# EAGLE design uduck (EAGLE 7.6.0)
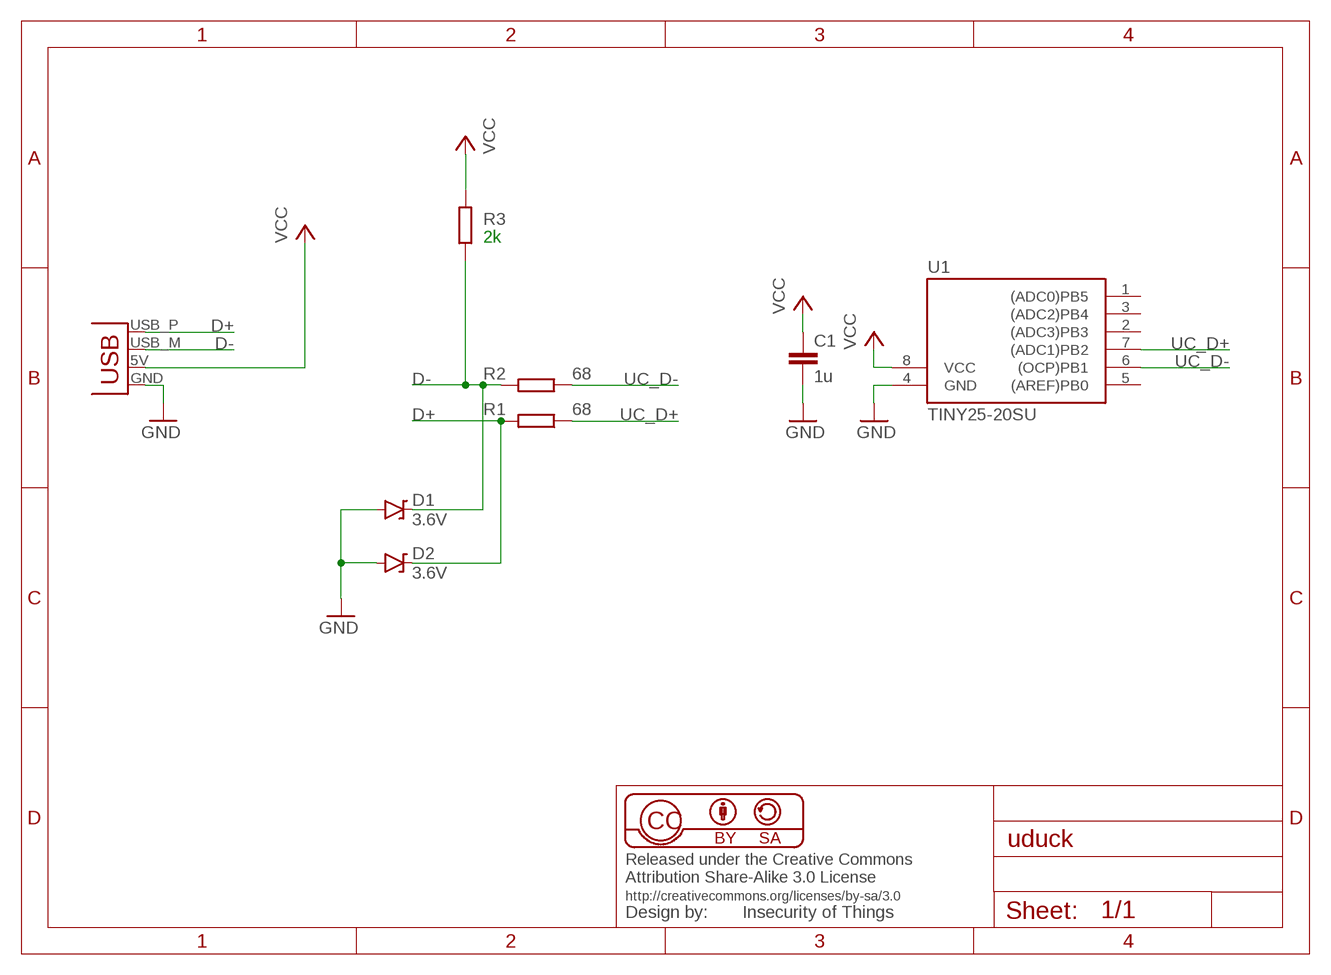
[diagram p0: schematic, sheet 1]

## Parts
C1  1u  C-EUC0805  [C0805]
D1  3.6V  DIODE-ZENER3.3V  [SOD-323]
D2  3.6V  DIODE-ZENER3.3V  [SOD-323]
R1  68  R-EU_R0603  [R0603]
R2  68  R-EU_R0603  [R0603]
R3  2k  R-EU_R0603  [R0603]
U1  TINY25-20SU  [SOIC8]
X1  USBPCB  [USB-A-PCB]

## Nets
D+: D2.C R1.2 X1.USB_P(D+)
D-: D1.C R2.2 R3.1 X1.USB_M(D-)
GND: C1.2 D1.A D2.A U1.4(GND) X1.GND
UC_D+: R1.1 U1.7((ADC1)PB2)
UC_D-: R2.1 U1.6((OCP)PB1)
VCC: C1.1 R3.2 U1.8(VCC) X1.5V(VBUS)
Unconnected: U1.1((ADC0)PB5) U1.2((ADC3)PB3) U1.3((ADC2)PB4) U1.5((AREF)PB0)

## Library data of the parts
C1 = rcl:C-EU: CAPACITOR, European symbol
D1 D2 = SparkFun-DiscreteSemi:DIODE-ZENER: Zener Diode Production Part - 8199 3.4V Zener Voltage; PROD_ID: DIO-11284; VALUE: 3.3V
R1-R3 = rcl:R-EU_: RESISTOR, European symbol
U1 = avr-5:TINY25
X1 = sparkfun:USB: USB Connectors USB-B-PTH is fully proven SKU : PRT-00139 USB-miniB is fully proven SKU : PRT-00587 USB-A-PCB is untested. USB-A-H is throughly reviewed, but untested. Spark Fun Electronics SKU : PRT-00437 USB-B-SMT is throughly reviewed, but untested. Needs silkscreen touching up. USB-A-S has not been used/tested USB-MB-H has not been used/tested

## Board
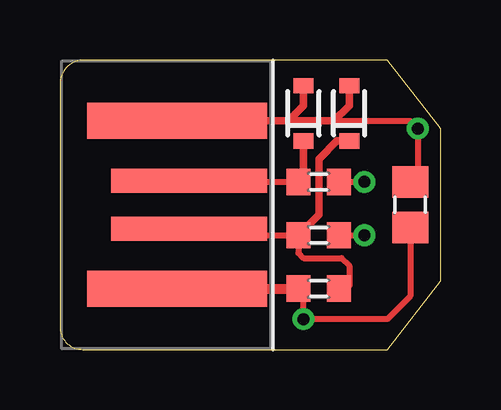
[diagram p1: board, top side]
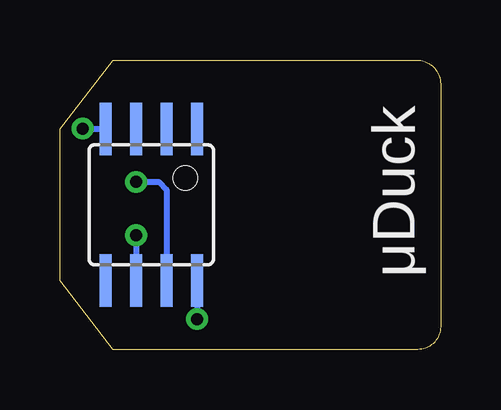
[diagram p2: board, bottom side, seen from below]

Size 15.88 x 12.06 mm. Coordinates in mm from the lower left corner, seen from the top.
Outline: 13.65,12.06 1,12.06 arc90 0,11.06 0,0.95 arc90 0.95,0 13.65,0 15.88,2.86 15.88,9.21 13.65,12.06
Copper layers (1*16): Top 0.035mm / dielectric 1.5mm / Bottom 0.035mm
Design rules "default": minimum track width 10mil, minimum drill 24mil, track to track 8mil, track to pad 8mil, pad to pad 8mil, via to via 8mil, smd to smd 8mil, copper to edge 40mil, drill to drill 8mil, minimum pad ring 10mil, minimum via ring 8mil, stop-mask expansion 4mil, vias tented up to drill 0mil, thermal gap 10mil

### Footprints (pad centres in the part's own frame; a part is rotated, then mirrored left to right if it is on the bottom)
C0805 = smd 1.3 x 1.5: 1 -0.95,0; 2 0.95,0
SOD-323 = smd 0.63 x 0.83: A 1.15,0; C -1.15,0
R0603 = smd 1 x 1.1: 1 -0.85,0; 2 0.85,0
SOIC8 = smd 0.5 x 2.2: 1 -1.905,-3.154; 2 -0.645,-3.154; 3 0.625,-3.154; 4 1.895,-3.154; 5 1.905,3.154; 6 0.635,3.154; 7 -0.635,3.154; 8 -1.905,3.154
USB-A-PCB = smd 7.5 x 1.5: 5V -0.2,-3.5; GND -0.2,3.5 | smd 6.5 x 1: USB_M 0.3,-1; USB_P 0.3,1

### Placement (x,y rotation side)
C1  14.61,6.03 90 top
D1  12.06,9.84 90 top
D2  10.16,9.84 90 top
R1  10.79,6.99 180 top
R2  10.79,4.76 180 top
R3  10.79,2.54 180 top
U1  12.06,6.03 180 bottom
X1  5.08,6.03 0 top

### Tracks (layer width: path | path; a pad name or v marks a point on that pad's centre or on a via)
D+
  Top 0.254: X1.USB_P 5.43,6.99 R1.2
  Top 0.305: D2.C 10.16,7.2 R1.2
D-
  Top 0.254: X1.USB_M 5.65,4.76 R2.2 9.95,4.03 10.16,3.81 11.75,3.81 12.06,3.49 12.06,2.64 R3.1
  Top 0.305: D1.C 11.55,8.69 10.79,7.94 10.79,5.61 R2.2
GND  (via drill 0.5 pad 0.25)
  Top 0.254: C1.2 14.92,7.3 v14.92,9.21 14.6,9.53 X1.GND
  Top 0.305: X1.GND 9.53,9.53 | 9.53,9.53 10.16,10.16 D2.A | 9.53,9.53 11.43,9.53 12.06,10.16 D1.A
  Bottom 0.254: U1.4 14.9,9.19 v14.92,9.21
UC_D+  (via drill 0.5 pad 0.25)
  Top 0.254: R1.1 v12.7,6.99
  Bottom 0.254: v12.7,6.99 11.75,6.99 11.43,6.67 U1.7
UC_D-  (via drill 0.5 pad 0.25)
  Top 0.254: R2.1 v12.7,4.76
  Bottom 0.254: v12.7,4.76 U1.6
VCC  (via drill 0.5 pad 0.25)
  Top 0.254: 10.26,2.53 R3.2 10.16,2.33 v10.16,1.27 13.65,1.27 14.61,2.22 C1.1
  Top 0.406: X1.5V R3.2
  Bottom 0.254: 10.16,2.86 U1.8 v10.16,1.27

### Text on the board
bNames: μDuck